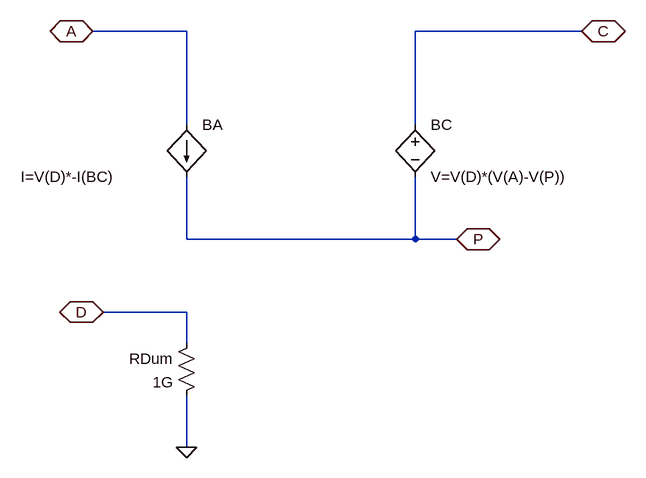
[diagram p0: schematic PWR_AVG.asc]
PWR_AVG.asc, the LTspice schematic file:
Version 4.1
SHEET 1 2180 2052
WIRE -48 -48 -192 -48
WIRE 560 -48 304 -48
WIRE -48 96 -48 -48
WIRE 304 96 304 -48
WIRE -48 272 -48 176
WIRE 304 272 304 176
WIRE 304 272 -48 272
WIRE 368 272 304 272
WIRE -48 384 -176 384
WIRE -48 432 -48 384
WIRE -48 592 -48 512
FLAG -48 592 0
FLAG -176 384 D
IOPIN -176 384 BiDir
FLAG -192 -48 A
IOPIN -192 -48 BiDir
FLAG 368 272 P
IOPIN 368 272 BiDir
FLAG 560 -48 C
IOPIN 560 -48 BiDir
SYMBOL bv 304 80 R0
SYMATTR InstName BC
SYMATTR Value V=V(D)*(V(A)-V(P))
SYMBOL bi -48 96 R0
WINDOW 3 -255 80 Left 2
SYMATTR Value I=V(D)*-I(BC)
SYMATTR InstName BA
SYMBOL res -32 416 M0
SYMATTR InstName RDum
SYMATTR Value 1G

The netlist it stands for:
* PWR_AVG.asc
BC C P V=V(D)*(V(A)-V(P))
BA A P I=V(D)*-I(BC)
RDum D 0 1G
.backanno
.end